# EAGLE design main (EAGLE 6.1)
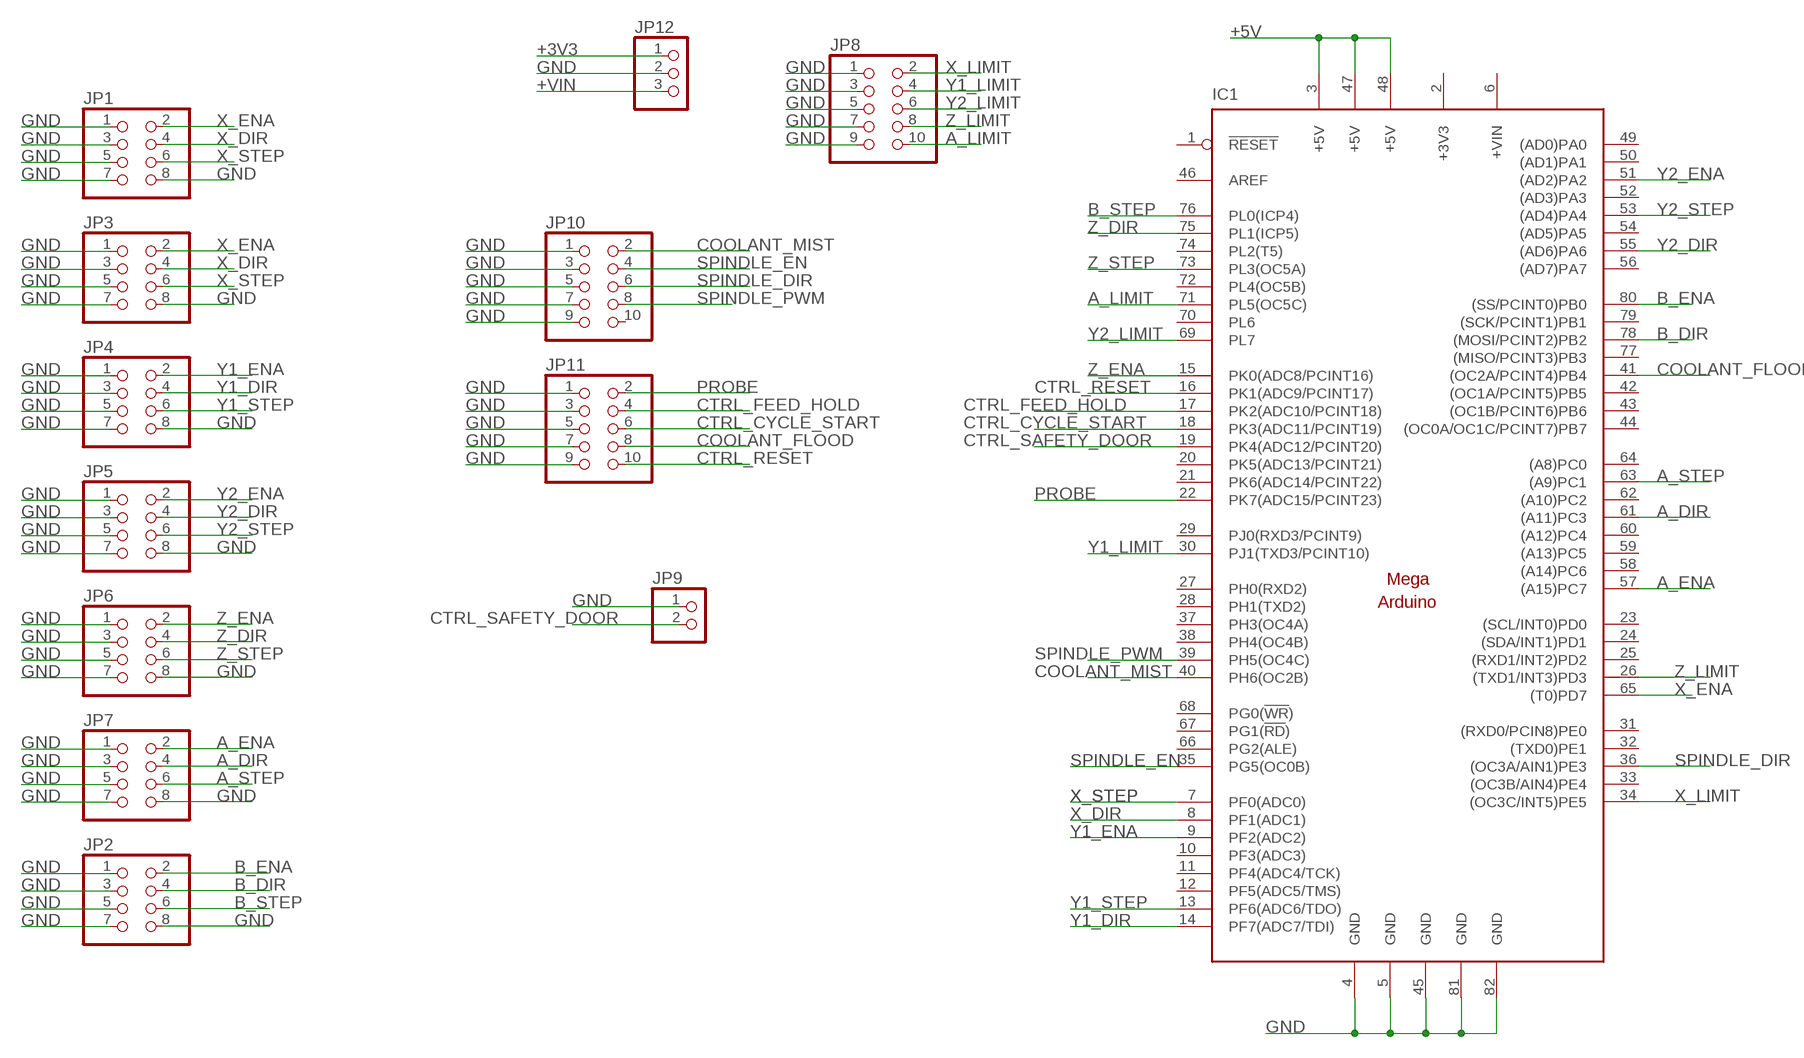
[diagram p0: schematic, sheet 1]

## Parts
IC1  MEGAARDUINO_1  [MEGA_ARDUINO]
JP1  PINHD-2X4  [2X04]
JP2  PINHD-2X4  [2X04]
JP3  PINHD-2X4  [2X04]
JP4  PINHD-2X4  [2X04]
JP5  PINHD-2X4  [2X04]
JP6  PINHD-2X4  [2X04]
JP7  PINHD-2X4  [2X04]
JP8  PINHD-2X5  [2X05]
JP9  PINHD-1X2  [1X02]
JP10  PINHD-2X5  [2X05]
JP11  PINHD-2X5  [2X05]
JP12  PINHD-1X3  [1X03]

## Nets
+3V3: JP12.1
+5V: IC1.3(+5V) IC1.47(+5V) IC1.48(+5V)
+VIN: JP12.3
A_DIR: IC1.61((A11)PC3) JP7.4
A_ENA: IC1.57((A15)PC7) JP7.2
A_LIMIT: IC1.71(PL5(OC5C)) JP8.10
A_STEP: IC1.63((A9)PC1) JP7.6
B_DIR: IC1.78((MOSI/PCINT2)PB2) JP2.4
B_ENA: IC1.80((SS/PCINT0)PB0) JP2.2
B_STEP: IC1.76(PL0(ICP4)) JP2.6
COOLANT_FLOOD: IC1.41((OC2A/PCINT4)PB4) JP11.8
COOLANT_MIST: IC1.40(PH6(OC2B)) JP10.2
CTRL_CYCLE_START: IC1.18(PK3(ADC11/PCINT19)) JP11.6
CTRL_FEED_HOLD: IC1.17(PK2(ADC10/PCINT18)) JP11.4
CTRL_RESET: IC1.16(PK1(ADC9/PCINT17)) JP11.10
CTRL_SAFETY_DOOR: IC1.19(PK4(ADC12/PCINT20)) JP9.2
GND: IC1.4(GND) IC1.5(GND) IC1.45(GND) IC1.81(GND) IC1.82(GND) JP1.1 JP1.3 JP1.5 JP1.7 JP1.8 JP2.1 JP2.3 JP2.5 JP2.7 JP2.8 JP3.1 JP3.3 JP3.5 JP3.7 JP3.8 JP4.1 JP4.3 JP4.5 JP4.7 JP4.8 JP5.1 JP5.3 JP5.5 JP5.7 JP5.8 JP6.1 JP6.3 JP6.5 JP6.7 JP6.8 JP7.1 JP7.3 JP7.5 JP7.7 JP7.8 JP8.1 JP8.3 JP8.5 JP8.7 JP8.9 JP9.1 JP10.1 JP10.3 JP10.5 JP10.7 JP10.9 JP11.1 JP11.3 JP11.5 JP11.7 JP11.9 JP12.2
PROBE: IC1.22(PK7(ADC15/PCINT23)) JP11.2
SPINDLE_DIR: IC1.36((OC3A/AIN1)PE3) JP10.6
SPINDLE_EN: IC1.35(PG5(OC0B)) JP10.4
SPINDLE_PWM: IC1.39(PH5(OC4C)) JP10.8
X_DIR: IC1.8(PF1(ADC1)) JP1.4 JP3.4
X_ENA: IC1.65((T0)PD7) JP1.2 JP3.2
X_LIMIT: IC1.34((OC3C/INT5)PE5) JP8.2
X_STEP: IC1.7(PF0(ADC0)) JP1.6 JP3.6
Y1_DIR: IC1.14(PF7(ADC7/TDI)) JP4.4
Y1_ENA: IC1.9(PF2(ADC2)) JP4.2
Y1_LIMIT: IC1.30(PJ1(TXD3/PCINT10)) JP8.4
Y1_STEP: IC1.13(PF6(ADC6/TDO)) JP4.6
Y2_DIR: IC1.55((AD6)PA6) JP5.4
Y2_ENA: IC1.51((AD2)PA2) JP5.2
Y2_LIMIT: IC1.69(PL7) JP8.6
Y2_STEP: IC1.53((AD4)PA4) JP5.6
Z_DIR: IC1.75(PL1(ICP5)) JP6.4
Z_ENA: IC1.15(PK0(ADC8/PCINT16)) JP6.2
Z_LIMIT: IC1.26((TXD1/INT3)PD3) JP8.8
Z_STEP: IC1.73(PL3(OC5A)) JP6.6
Unconnected: IC1.1(!RESET) IC1.10(PF3(ADC3)) IC1.11(PF4(ADC4/TCK)) IC1.12(PF5(ADC5/TMS)) IC1.20(PK5(ADC13/PCINT21)) IC1.21(PK6(ADC14/PCINT22)) IC1.23((SCL/INT0)PD0) IC1.24((SDA/INT1)PD1) IC1.25((RXD1/INT2)PD2) IC1.27(PH0(RXD2)) IC1.28(PH1(TXD2)) IC1.29(PJ0(RXD3/PCINT9)) IC1.31((RXD0/PCIN8)PE0) IC1.32((TXD0)PE1) IC1.33((OC3B/AIN4)PE4) IC1.37(PH3(OC4A)) IC1.38(PH4(OC4B)) IC1.42((OC1A/PCINT5)PB5) IC1.43((OC1B/PCINT6)PB6) IC1.44((OC0A/OC1C/PCINT7)PB7) IC1.46(AREF) IC1.49((AD0)PA0) IC1.50((AD1)PA1) IC1.52((AD3)PA3) IC1.54((AD5)PA5) IC1.56((AD7)PA7) IC1.58((A14)PC6) IC1.59((A13)PC5) IC1.60((A12)PC4) IC1.62((A10)PC2) IC1.64((A8)PC0) IC1.66(PG2(ALE)) IC1.67(PG1(!RD!)) IC1.68(PG0(!WR!)) IC1.70(PL6) IC1.72(PL4(OC5B)) IC1.74(PL2(T5)) IC1.77((MISO/PCINT3)PB3) IC1.79((SCK/PCINT1)PB1) JP10.10

## Power pins joined to a net without a drawn wire
+3V3: IC1.2(+3V3)
+VIN: IC1.6(+VIN)

## Library data of the parts
IC1 = arduino:MEGAARDUINO_1: The Arduino Mega is a microcontroller board based on the ATmega1280. - 54 digital input/output pins (of which 14 can be used as PWM outputs) - 16 analog inputs - 4 UARTs (hardware serial ports) - 16 MHz crystal oscillator - USB connection - power jack - ICSP header - reset button It contains everything needed to support the microcontroller; simply connect it to a computer with a USB cable or power it with a AC-to-DC adapter or battery to get started. The Mega is compatible with most shields designed for the Arduino Duemilanove or Diecimila. http://arduino.cc/en/Main/ArduinoBoardMega
JP1-JP7 = pinhead:PINHD-2X4: PIN HEADER
JP8 JP10 JP11 = pinhead:PINHD-2X5: PIN HEADER
JP9 = pinhead:PINHD-1X2: PIN HEADER
JP12 = adafruit:PINHD-1X3: PIN HEADER

## Board
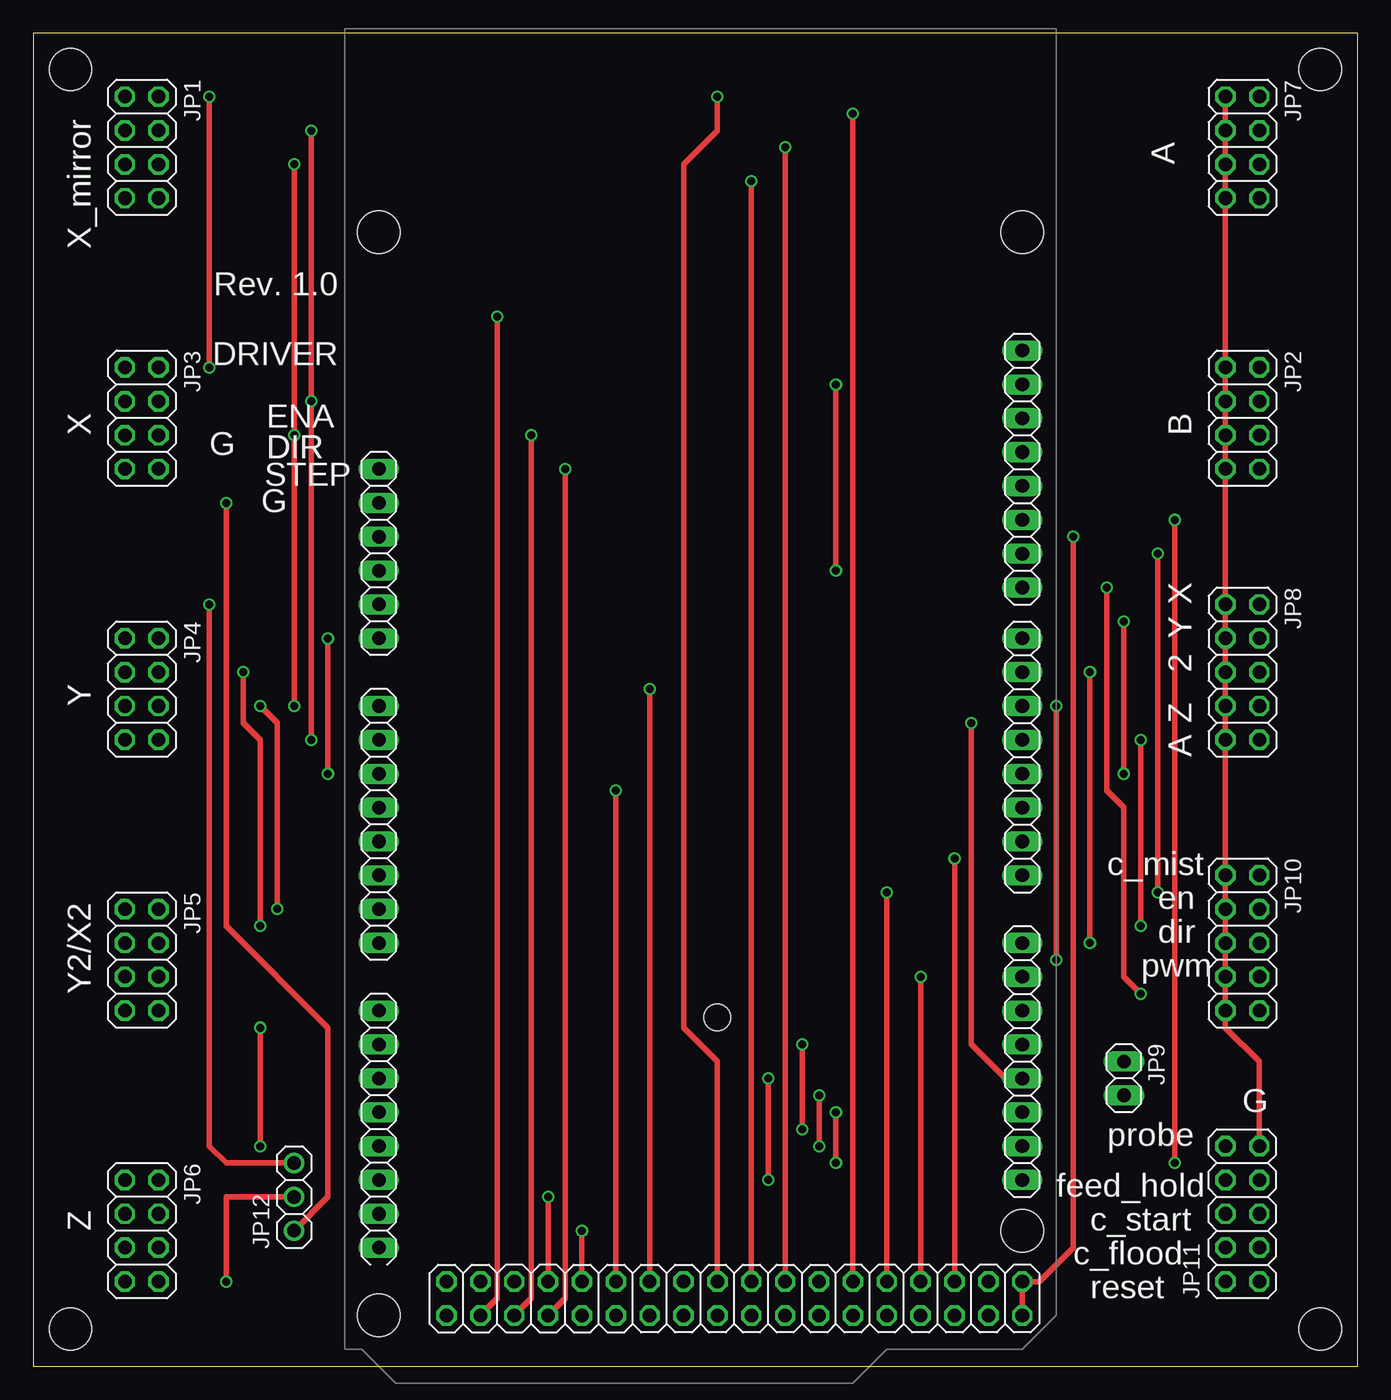
[diagram p1: board, top side]
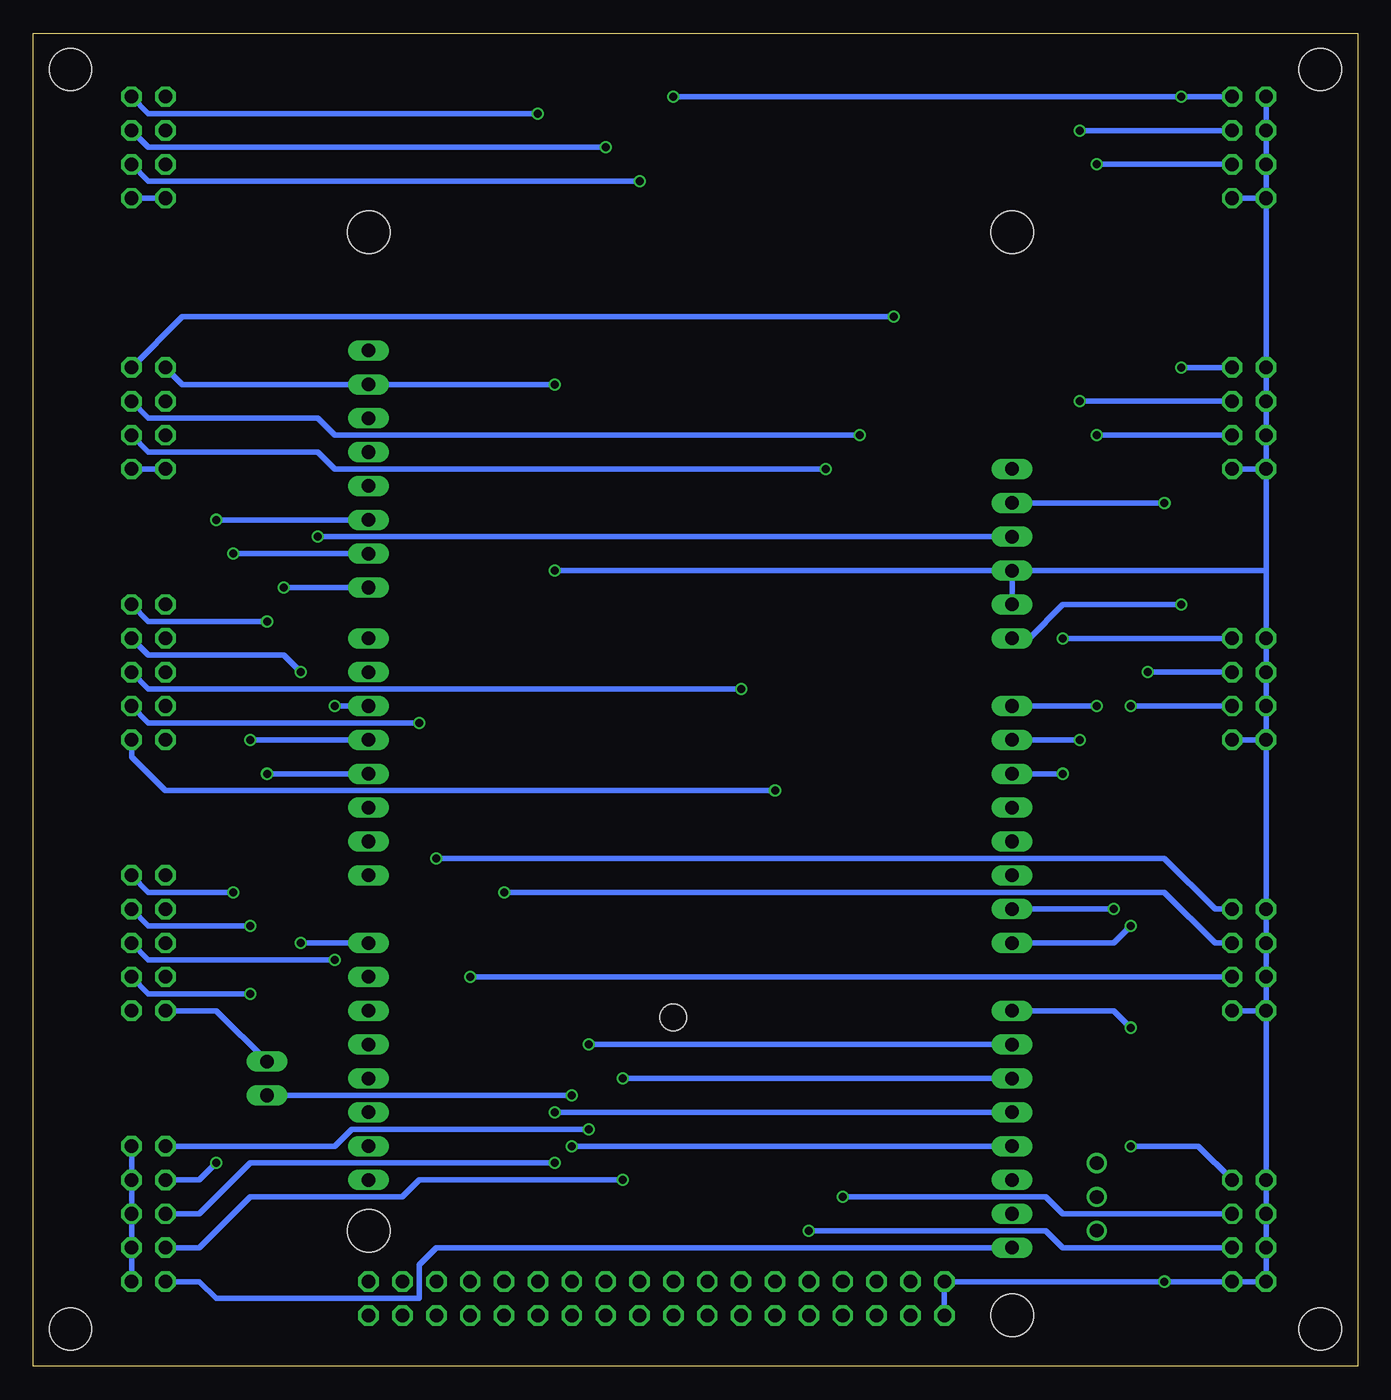
[diagram p2: board, bottom side, seen from below]

Size 99.31 x 100 mm. Coordinates in mm from the lower left corner, seen from the top.
Outline: 0,0 99.31,0 99.31,100 0,100 0,0
Copper layers (1*16): Top 0.035mm / dielectric 1.5mm / Bottom 0.035mm
Design rules: minimum track width 6mil, minimum drill 12mil, track to track 6mil, track to pad 6mil, pad to pad 6mil, via to via 6mil, smd to smd 0mil, copper to edge 10mil, drill to drill 10mil, minimum pad ring 10mil, minimum via ring 6mil, stop-mask expansion 2mil, vias tented up to drill 100mil, thermal gap 10mil
Holes 3.17 mm at 2.79,97.28 96.52,97.28 96.52,2.79 2.79,2.79

### Footprints (pad centres in the part's own frame; a part is rotated, then mirrored left to right if it is on the bottom)
MEGA_ARDUINO = drill 1.016 long: 1 33.02,2.54; 2 35.56,2.54; 3 38.1,2.54; 4 40.64,2.54; 5 43.18,2.54; 6 45.72,2.54; 7 50.8,2.54; 8 53.34,2.54; 9 55.88,2.54; 10 58.42,2.54; 11 60.96,2.54; 12 63.5,2.54; 13 66.04,2.54; 14 68.58,2.54; 15 73.66,2.54; 16 76.2,2.54; 17 78.74,2.54; 18 81.28,2.54; 19 83.82,2.54; 20 86.36,2.54; 21 88.9,2.54; 22 91.44,2.54; 23 86.36,50.8; 24 83.82,50.8; 25 81.28,50.8; 26 78.74,50.8; 27 76.2,50.8; 28 73.66,50.8; 29 71.12,50.8; 30 68.58,50.8; 31 63.5,50.8; 32 60.96,50.8; 33 58.42,50.8; 34 55.88,50.8; 35 53.34,50.8; 36 50.8,50.8; 37 48.26,50.8; 38 45.72,50.8; 39 41.91,50.8; 40 39.37,50.8; 41 36.83,50.8; 42 34.29,50.8; 43 31.75,50.8; 44 29.21,50.8; 45 26.67,50.8; 46 24.13,50.8 | drill 1.016 octagon: 47 93.98,50.8; 48 96.52,50.8; 49 93.98,48.26; 50 96.52,48.26; 51 93.98,45.72; 52 96.52,45.72; 53 93.98,43.18; 54 96.52,43.18; 55 93.98,40.64; 56 96.52,40.64; 57 93.98,38.1; 58 96.52,38.1; 59 93.98,35.56; 60 96.52,35.56; 61 93.98,33.02; 62 96.52,33.02; 63 93.98,30.48; 64 96.52,30.48; 65 93.98,27.94; 66 96.52,27.94; 67 93.98,25.4; 68 96.52,25.4; 69 93.98,22.86; 70 96.52,22.86; 71 93.98,20.32; 72 96.52,20.32; 73 93.98,17.78; 74 96.52,17.78; 75 93.98,15.24; 76 96.52,15.24; 77 93.98,12.7; 78 96.52,12.7; 79 93.98,10.16; 80 96.52,10.16; 81 93.98,7.62; 82 96.52,7.62 | hole 3.2: 15.24,50.8; 15.24,2.54; 90.17,50.8; 96.52,2.54 | hole 2: 74.168,27.94
2X04 = drill 1.016 octagon: 1 -3.81,-1.27; 2 -3.81,1.27; 3 -1.27,-1.27; 4 -1.27,1.27; 5 1.27,-1.27; 6 1.27,1.27; 7 3.81,-1.27; 8 3.81,1.27
2X05 = drill 1.016 octagon: 1 -5.08,-1.27; 2 -5.08,1.27; 3 -2.54,-1.27; 4 -2.54,1.27; 5 0,-1.27; 6 0,1.27; 7 2.54,-1.27; 8 2.54,1.27; 9 5.08,-1.27; 10 5.08,1.27
1X02 = drill 1.016 long: 1 -1.27,0; 2 1.27,0
1X03 = drill 1.016: 1 -2.54,0; 2 0,0; 3 2.54,0

### Placement (x,y rotation side)
IC1  23.37,100.33 270 top
JP1  8.13,91.44 270 top
JP2  90.68,71.12 270 top
JP3  8.13,71.12 270 top
JP4  8.13,50.8 270 top
JP5  8.13,30.48 270 top
JP6  8.13,10.16 270 top
JP7  90.68,91.44 270 top
JP8  90.68,52.07 270 top
JP9  81.79,21.59 270 top
JP10  90.68,31.75 270 top
JP11  90.68,11.43 90 top
JP12  19.56,12.7 90 top

### Tracks (layer width: path | path; a pad name or v marks a point on that pad's centre or on a via)
+3V3  (via drill 0.6)
  Top 0.406: v14.48,64.77 14.48,33.02 22.1,25.4 22.1,12.7 JP12.1
  Bottom 0.406: IC1.2 v14.48,64.77
+5V  (via drill 0.6)
  Top 0.406: IC1.48 IC1.47 75.44,6.35 77.98,8.89 v77.98,62.23
  Bottom 0.406: IC1.3 v77.98,62.23
+VIN  (via drill 0.6)
  Top 0.406: v13.21,57.15 13.21,16.51 14.48,15.24 JP12.3
  Bottom 0.406: IC1.6 24.64,54.61 22.1,57.15 v13.21,57.15
A_DIR  (via drill 0.6)
  Top 0.406: v56.39,91.44 IC1.61
  Bottom 0.406: JP7.4 90.68,91.44 v56.39,91.44
A_ENA  (via drill 0.6)
  Top 0.406: v61.47,93.98 IC1.57
  Bottom 0.406: JP7.2 90.68,93.98 v61.47,93.98
A_LIMIT  (via drill 0.6)
  Top 0.406: IC1.71 v43.69,43.18
  Bottom 0.406: JP8.10 91.95,45.72 89.41,43.18 v43.69,43.18
A_STEP  (via drill 0.6)
  Top 0.406: v53.85,88.9 IC1.63
  Bottom 0.406: JP7.6 90.68,88.9 v53.85,88.9
B_DIR  (via drill 0.6)
  Top 0.406: IC1.78 37.34,5.08 v37.34,69.85
  Bottom 0.406: JP2.4 90.68,71.12 77.98,71.12 76.71,69.85 v37.34,69.85
B_ENA  (via drill 0.6)
  Top 0.406: IC1.80 34.8,5.08 v34.8,78.74
  Bottom 0.406: JP2.2 88.14,78.74 v34.8,78.74
B_STEP  (via drill 0.6)
  Top 0.406: IC1.76 39.88,5.08 v39.88,67.31
  Bottom 0.406: JP2.6 90.68,68.58 77.98,68.58 76.71,67.31 v39.88,67.31
COOLANT_FLOOD  (via drill 0.6)
  Top 0.406: v85.6,15.24 v85.6,63.5
  Bottom 0.406: JP11.8 86.87,13.97 v85.6,15.24 | v85.6,63.5 IC1.41
COOLANT_MIST  (via drill 0.6)
  Top 0.406: v84.33,35.56 v84.33,60.96
  Bottom 0.406: JP10.2 90.68,35.56 v84.33,35.56 | v84.33,60.96 IC1.40
CTRL_CYCLE_START  (via drill 0.6)
  Top 0.406: v60.2,19.05 v60.2,15.24
  Bottom 0.406: IC1.18 v60.2,19.05 | v60.2,15.24 83.06,15.24 86.87,11.43 JP11.6
CTRL_FEED_HOLD  (via drill 0.6)
  Top 0.406: v55.12,21.59 v55.12,13.97
  Bottom 0.406: IC1.17 v55.12,21.59 | v55.12,13.97 70.36,13.97 71.63,12.7 83.06,12.7 86.87,8.89 JP11.4
CTRL_RESET  (via drill 0.6)
  Top 0.406: v57.66,17.78 v57.66,24.13
  Bottom 0.406: IC1.16 v57.66,24.13 | JP11.10 76.71,16.51 75.44,17.78 v57.66,17.78
CTRL_SAFETY_DOOR  (via drill 0.6)
  Top 0.406: v58.93,16.51 v58.93,20.32
  Bottom 0.406: IC1.19 v58.93,16.51 | v58.93,20.32 JP9.2
GND  (via drill 0.6)
  Top 0.406: v14.48,6.35 14.48,12.7 JP12.2 | v60.2,73.66 v60.2,59.69 | JP11.9 91.95,22.86 89.41,25.4 JP10.9 JP10.7 JP10.5 JP10.3 JP10.1 JP8.9 JP8.7 JP8.5 JP8.3 JP8.1 JP2.7 JP2.5 JP2.3 JP2.1 JP7.7 JP7.5 JP7.3 JP7.1
  Bottom 0.406: IC1.4 IC1.5 | IC1.4 6.86,59.69 | 6.86,59.69 JP3.7 | 6.86,59.69 JP4.1 JP4.3 JP4.5 JP4.7 | JP3.7 JP3.8 | JP3.7 JP3.5 JP3.3 JP3.1 JP1.7 | JP1.8 JP1.7 | JP4.8 JP4.7 | JP4.7 JP5.1 JP5.3 JP5.5 JP5.7 | JP5.7 JP5.8 | JP5.7 JP6.1 JP6.3 JP6.5 JP6.7 JP6.8 v14.48,6.35 IC1.81 IC1.82 | IC1.4 v60.2,59.69 | JP11.9 JP11.7 JP11.5 JP11.3 JP11.1 | JP10.9 85.6,26.67 JP9.1 | JP2.8 JP2.7 | JP2.1 88.14,73.66 IC1.45 v60.2,73.66 | JP7.7 JP7.8 | JP1.1 JP1.3 JP1.5 JP1.7
PROBE
  Bottom 0.406: IC1.22 69.09,8.89 70.36,7.62 70.36,5.08 85.6,5.08 86.87,6.35 JP11.2
SPINDLE_DIR  (via drill 0.6)
  Top 0.406: v76.71,49.53 v76.71,30.48
  Bottom 0.406: JP10.6 90.68,30.48 v76.71,30.48 | IC1.36 v76.71,49.53
SPINDLE_EN  (via drill 0.6)
  Top 0.406: v83.06,33.02 v83.06,46.99
  Bottom 0.406: JP10.4 90.68,33.02 v83.06,33.02 | v83.06,46.99 IC1.35
SPINDLE_PWM  (via drill 0.6)
  Top 0.406: v83.06,27.94 81.79,29.21 81.79,41.91 80.52,43.18 v80.52,58.42
  Bottom 0.406: JP10.8 90.68,27.94 v83.06,27.94 | v80.52,58.42 IC1.39
X_DIR  (via drill 0.6)
  Top 0.406: v20.83,46.99 v20.83,72.39 v20.83,92.71
  Bottom 0.406: IC1.8 v20.83,46.99 | v20.83,72.39 JP3.4 | JP1.4 v20.83,92.71
X_ENA  (via drill 0.6)
  Top 0.406: v13.21,74.93 v13.21,95.25 | IC1.65 51.31,22.86 48.77,25.4 48.77,90.17 51.31,92.71 v51.31,95.25
  Bottom 0.406: JP3.2 v13.21,74.93 | v13.21,95.25 JP1.2 v51.31,95.25
X_LIMIT  (via drill 0.6)
  Top 0.406: v81.79,55.88 v81.79,44.45
  Bottom 0.406: JP8.2 90.68,55.88 v81.79,55.88 | v81.79,44.45 IC1.34
X_STEP  (via drill 0.6)
  Top 0.406: v19.56,49.53 v19.56,69.85 v19.56,90.17
  Bottom 0.406: IC1.7 v19.56,49.53 | v19.56,69.85 JP3.6 | JP1.6 v19.56,90.17
Y1_DIR  (via drill 0.6)
  Top 0.406: v17.02,33.02 17.02,46.99 15.75,48.26 v15.75,52.07
  Bottom 0.406: IC1.14 18.29,31.75 v17.02,33.02 | v15.75,52.07 JP4.4
Y1_ENA  (via drill 0.6)
  Top 0.406: v22.1,44.45 v22.1,54.61
  Bottom 0.406: IC1.9 v22.1,44.45 | v22.1,54.61 JP4.2
Y1_LIMIT  (via drill 0.6)
  Top 0.406: v79.25,52.07 v79.25,31.75
  Bottom 0.406: JP8.4 90.68,53.34 80.52,53.34 v79.25,52.07 | v79.25,31.75 IC1.30
Y1_STEP  (via drill 0.6)
  Top 0.406: v18.29,34.29 18.29,48.26 v17.02,49.53
  Bottom 0.406: IC1.13 v18.29,34.29 | v17.02,49.53 JP4.6
Y2_DIR  (via drill 0.6)
  Top 0.406: IC1.55 v64.01,35.56
  Bottom 0.406: JP5.4 10.67,31.75 14.48,35.56 v64.01,35.56
Y2_ENA  (via drill 0.6)
  Top 0.406: IC1.51 v69.09,38.1
  Bottom 0.406: JP5.2 10.67,34.29 14.48,38.1 v69.09,38.1
Y2_LIMIT  (via drill 0.6)
  Top 0.406: IC1.69 v46.23,50.8
  Bottom 0.406: JP8.6 90.68,50.8 v46.23,50.8
Y2_STEP  (via drill 0.6)
  Top 0.406: IC1.53 v66.55,29.21
  Bottom 0.406: JP5.6 v66.55,29.21
Z_DIR  (via drill 0.6)
  Top 0.406: v38.61,12.7 IC1.75
  Bottom 0.406: JP6.4 22.1,11.43 23.37,12.7 v38.61,12.7
Z_ENA  (via drill 0.6)
  Top 0.406: v17.02,25.4 v17.02,16.51
  Bottom 0.406: IC1.15 18.29,26.67 v17.02,25.4 | v17.02,16.51 11.94,16.51 JP6.2
Z_LIMIT  (via drill 0.6)
  Top 0.406: v70.36,48.26 70.36,24.13 72.9,21.59 IC1.26
  Bottom 0.406: JP8.8 90.68,48.26 v70.36,48.26
Z_STEP  (via drill 0.6)
  Top 0.406: v41.15,10.16 IC1.73
  Bottom 0.406: JP6.6 22.1,8.89 23.37,10.16 v41.15,10.16

### Text on the board
tNames: A | X_mirror | Rev. 1.0 | DRIVER | X | ENA | B | G | DIR | DIR | STEP | G | X | Y | 2 | Y | Z | A | c_mist | en | dir | pwm | Y2/X2 | G | probe | feed_hold | Z | c_start | c_flood | reset